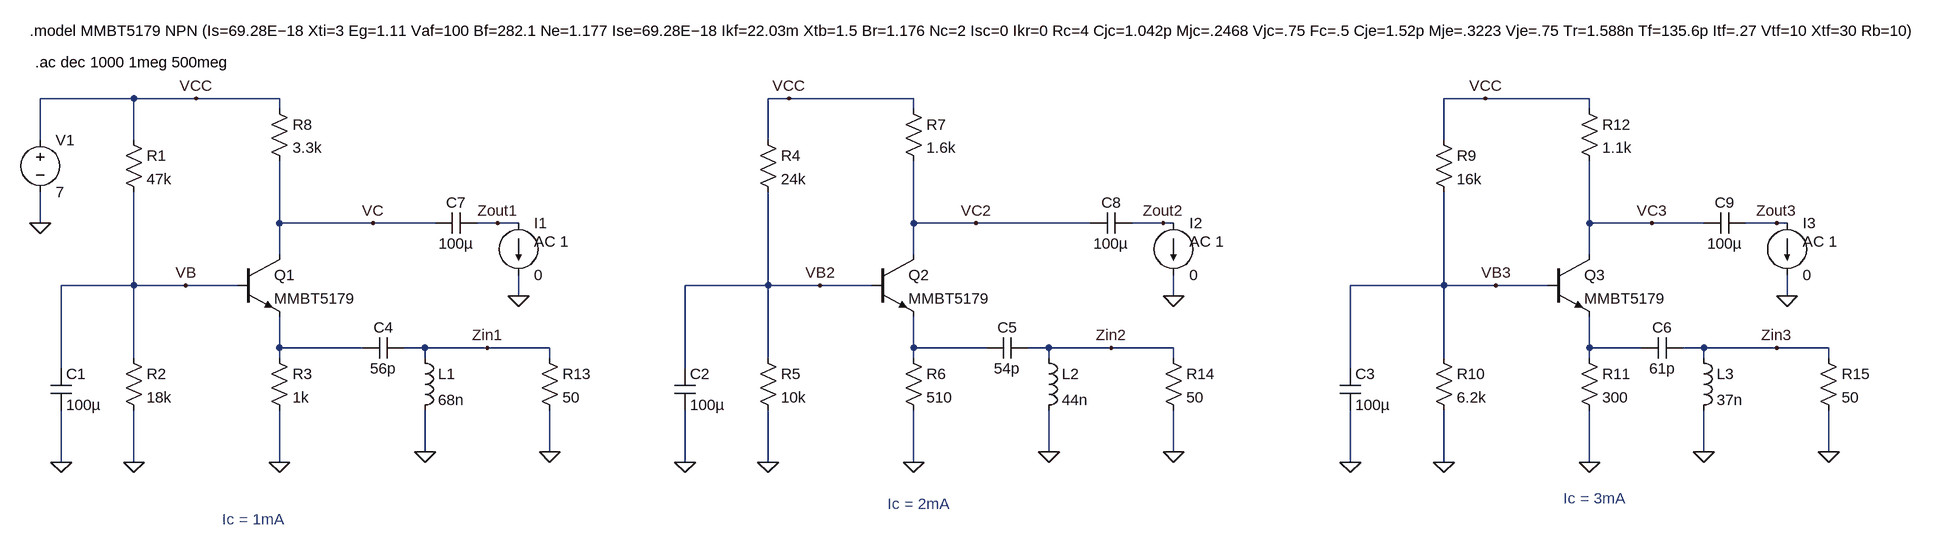
[diagram p0: schematic 5_Output_Impedance.asc]
5_Output_Impedance.asc, the LTspice schematic file:
Version 4
SHEET 1 1332 680
WIRE -2304 -1792 -2448 -1792
WIRE -2208 -1792 -2304 -1792
WIRE -2080 -1792 -2208 -1792
WIRE -1296 -1792 -1328 -1792
WIRE -1104 -1792 -1296 -1792
WIRE -224 -1792 -288 -1792
WIRE -64 -1792 -224 -1792
WIRE -2080 -1776 -2080 -1792
WIRE -1104 -1776 -1104 -1792
WIRE -64 -1776 -64 -1792
WIRE -2448 -1728 -2448 -1792
WIRE -2304 -1728 -2304 -1792
WIRE -1328 -1728 -1328 -1792
WIRE -288 -1728 -288 -1792
WIRE -2448 -1600 -2448 -1648
WIRE -2080 -1600 -2080 -1696
WIRE -1936 -1600 -2080 -1600
WIRE -1840 -1600 -1936 -1600
WIRE -1744 -1600 -1776 -1600
WIRE -1712 -1600 -1744 -1600
WIRE -1104 -1600 -1104 -1696
WIRE -1008 -1600 -1104 -1600
WIRE -832 -1600 -1008 -1600
WIRE -720 -1600 -768 -1600
WIRE -704 -1600 -720 -1600
WIRE -64 -1600 -64 -1696
WIRE 32 -1600 -64 -1600
WIRE 112 -1600 32 -1600
WIRE 224 -1600 176 -1600
WIRE 240 -1600 224 -1600
WIRE -2080 -1552 -2080 -1600
WIRE -1104 -1552 -1104 -1600
WIRE -64 -1552 -64 -1600
WIRE -2304 -1504 -2304 -1648
WIRE -2304 -1504 -2416 -1504
WIRE -2224 -1504 -2304 -1504
WIRE -2144 -1504 -2224 -1504
WIRE -1328 -1504 -1328 -1648
WIRE -1328 -1504 -1456 -1504
WIRE -1248 -1504 -1328 -1504
WIRE -1168 -1504 -1248 -1504
WIRE -288 -1504 -288 -1648
WIRE -288 -1504 -432 -1504
WIRE -208 -1504 -288 -1504
WIRE -128 -1504 -208 -1504
WIRE -1712 -1488 -1712 -1520
WIRE -704 -1488 -704 -1520
WIRE 240 -1488 240 -1520
WIRE -2080 -1408 -2080 -1456
WIRE -1952 -1408 -2080 -1408
WIRE -1856 -1408 -1888 -1408
WIRE -1760 -1408 -1856 -1408
WIRE -1664 -1408 -1760 -1408
WIRE -1104 -1408 -1104 -1456
WIRE -992 -1408 -1104 -1408
WIRE -896 -1408 -928 -1408
WIRE -800 -1408 -896 -1408
WIRE -704 -1408 -800 -1408
WIRE -64 -1408 -64 -1456
WIRE 16 -1408 -64 -1408
WIRE 112 -1408 80 -1408
WIRE 224 -1408 112 -1408
WIRE 304 -1408 224 -1408
WIRE -2304 -1392 -2304 -1504
WIRE -2080 -1392 -2080 -1408
WIRE -1856 -1392 -1856 -1408
WIRE -1664 -1392 -1664 -1408
WIRE -1328 -1392 -1328 -1504
WIRE -1104 -1392 -1104 -1408
WIRE -896 -1392 -896 -1408
WIRE -704 -1392 -704 -1408
WIRE -288 -1392 -288 -1504
WIRE -64 -1392 -64 -1408
WIRE 112 -1392 112 -1408
WIRE 304 -1392 304 -1408
WIRE -2416 -1376 -2416 -1504
WIRE -1456 -1376 -1456 -1504
WIRE -432 -1376 -432 -1504
WIRE -1856 -1248 -1856 -1312
WIRE -1664 -1248 -1664 -1312
WIRE -896 -1248 -896 -1312
WIRE -704 -1248 -704 -1312
WIRE 112 -1248 112 -1312
WIRE 304 -1248 304 -1312
WIRE -2416 -1232 -2416 -1312
WIRE -2304 -1232 -2304 -1312
WIRE -2080 -1232 -2080 -1312
WIRE -1456 -1232 -1456 -1312
WIRE -1328 -1232 -1328 -1312
WIRE -1104 -1232 -1104 -1312
WIRE -432 -1232 -432 -1312
WIRE -288 -1232 -288 -1312
WIRE -64 -1232 -64 -1312
FLAG -2448 -1600 0
FLAG -2304 -1232 0
FLAG -2080 -1232 0
FLAG -2224 -1504 VB
FLAG -1936 -1600 VC
FLAG -2208 -1792 VCC
FLAG -2416 -1232 0
FLAG -1328 -1232 0
FLAG -1104 -1232 0
FLAG -1248 -1504 VB2
FLAG -1008 -1600 VC2
FLAG -1296 -1792 VCC
FLAG -1456 -1232 0
FLAG -288 -1232 0
FLAG -64 -1232 0
FLAG -208 -1504 VB3
FLAG 32 -1600 VC3
FLAG -432 -1232 0
FLAG -224 -1792 VCC
FLAG -1664 -1248 0
FLAG -1856 -1248 0
FLAG -704 -1248 0
FLAG -896 -1248 0
FLAG 304 -1248 0
FLAG 112 -1248 0
FLAG -1760 -1408 Zin1
FLAG -800 -1408 Zin2
FLAG 224 -1408 Zin3
FLAG -1712 -1488 0
FLAG -704 -1488 0
FLAG 240 -1488 0
FLAG -1744 -1600 Zout1
FLAG -720 -1600 Zout2
FLAG 224 -1600 Zout3
SYMBOL res -2320 -1744 R0
SYMATTR InstName R1
SYMATTR Value 47k
SYMBOL res -2320 -1408 R0
SYMATTR InstName R2
SYMATTR Value 18k
SYMBOL res -2096 -1408 R0
SYMATTR InstName R3
SYMATTR Value 1k
SYMBOL voltage -2448 -1744 R0
WINDOW 123 0 0 Left 0
WINDOW 39 0 0 Left 0
SYMATTR InstName V1
SYMATTR Value 7
SYMBOL npn -2144 -1552 R0
SYMATTR InstName Q1
SYMATTR Value MMBT5179
SYMBOL cap -2432 -1376 R0
SYMATTR InstName C1
SYMATTR Value 100µ
SYMBOL res -1344 -1744 R0
SYMATTR InstName R4
SYMATTR Value 24k
SYMBOL res -1344 -1408 R0
SYMATTR InstName R5
SYMATTR Value 10k
SYMBOL res -1120 -1408 R0
SYMATTR InstName R6
SYMATTR Value 510
SYMBOL npn -1168 -1552 R0
SYMATTR InstName Q2
SYMATTR Value MMBT5179
SYMBOL cap -1472 -1376 R0
SYMATTR InstName C2
SYMATTR Value 100µ
SYMBOL res -1120 -1792 R0
SYMATTR InstName R7
SYMATTR Value 1.6k
SYMBOL res -2096 -1792 R0
SYMATTR InstName R8
SYMATTR Value 3.3k
SYMBOL res -304 -1744 R0
SYMATTR InstName R9
SYMATTR Value 16k
SYMBOL res -304 -1408 R0
SYMATTR InstName R10
SYMATTR Value 6.2k
SYMBOL res -80 -1408 R0
SYMATTR InstName R11
SYMATTR Value 300
SYMBOL npn -128 -1552 R0
SYMATTR InstName Q3
SYMATTR Value MMBT5179
SYMBOL cap -448 -1376 R0
SYMATTR InstName C3
SYMATTR Value 100µ
SYMBOL res -80 -1792 R0
SYMATTR InstName R12
SYMATTR Value 1.1k
SYMBOL cap -1888 -1424 R90
WINDOW 0 0 32 VBottom 2
WINDOW 3 32 32 VTop 2
SYMATTR InstName C4
SYMATTR Value 56p
SYMBOL ind -1872 -1408 R0
SYMATTR InstName L1
SYMATTR Value 68n
SYMBOL cap -928 -1424 R90
WINDOW 0 0 32 VBottom 2
WINDOW 3 32 32 VTop 2
SYMATTR InstName C5
SYMATTR Value 54p
SYMBOL ind -912 -1408 R0
SYMATTR InstName L2
SYMATTR Value 44n
SYMBOL cap 80 -1424 R90
WINDOW 0 0 32 VBottom 2
WINDOW 3 32 32 VTop 2
SYMATTR InstName C6
SYMATTR Value 61p
SYMBOL ind 96 -1408 R0
SYMATTR InstName L3
SYMATTR Value 37n
SYMBOL res -1680 -1408 R0
SYMATTR InstName R13
SYMATTR Value 50
SYMBOL res -720 -1408 R0
SYMATTR InstName R14
SYMATTR Value 50
SYMBOL res 288 -1408 R0
SYMATTR InstName R15
SYMATTR Value 50
SYMBOL current -1712 -1600 R0
WINDOW 123 24 28 Left 2
WINDOW 39 0 0 Left 0
SYMATTR InstName I1
SYMATTR Value 0
SYMATTR Value2 AC 1
SYMBOL cap -1776 -1616 R90
WINDOW 0 0 32 VBottom 2
WINDOW 3 32 32 VTop 2
SYMATTR InstName C7
SYMATTR Value 100µ
SYMBOL current -704 -1600 R0
WINDOW 123 24 28 Left 2
WINDOW 39 0 0 Left 0
SYMATTR InstName I2
SYMATTR Value 0
SYMATTR Value2 AC 1
SYMBOL cap -768 -1616 R90
WINDOW 0 0 32 VBottom 2
WINDOW 3 32 32 VTop 2
SYMATTR InstName C8
SYMATTR Value 100µ
SYMBOL current 240 -1600 R0
WINDOW 123 24 28 Left 2
WINDOW 39 0 0 Left 0
SYMATTR InstName I3
SYMATTR Value 0
SYMATTR Value2 AC 1
SYMBOL cap 176 -1616 R90
WINDOW 0 0 32 VBottom 2
WINDOW 3 32 32 VTop 2
SYMATTR InstName C9
SYMATTR Value 100µ
TEXT -2464 -1896 Left 2 !.model MMBT5179 NPN (Is=69.28E−18 Xti=3 Eg=1.11 Vaf=100 Bf=282.1 Ne=1.177 Ise=69.28E−18 Ikf=22.03m Xtb=1.5 Br=1.176 Nc=2 Isc=0 Ikr=0 Rc=4 Cjc=1.042p Mjc=.2468 Vjc=.75 Fc=.5 Cje=1.52p Mje=.3223 Vje=.75 Tr=1.588n Tf=135.6p Itf=.27 Vtf=10 Xtf=30 Rb=10)
TEXT -2456 -1848 Left 2 !.ac dec 1000 1meg 500meg
TEXT -2168 -1144 Left 2 ;Ic = 1mA
TEXT -1144 -1168 Left 2 ;Ic = 2mA
TEXT -104 -1176 Left 2 ;Ic = 3mA

The netlist it stands for:
* 5_Output_Impedance.asc
R1 VCC VB 47k
R2 VB 0 18k
R3 N001 0 1k
V1 VCC 0 7
Q1 VC VB N001 0 MMBT5179
C1 VB 0 100µ
R4 VCC VB2 24k
R5 VB2 0 10k
R6 N002 0 510
Q2 VC2 VB2 N002 0 MMBT5179
C2 VB2 0 100µ
R7 VCC VC2 1.6k
R8 VCC VC 3.3k
R9 VCC VB3 16k
R10 VB3 0 6.2k
R11 N003 0 300
Q3 VC3 VB3 N003 0 MMBT5179
C3 VB3 0 100µ
R12 VCC VC3 1.1k
C4 Zin1 N001 56p
L1 Zin1 0 68n
C5 Zin2 N002 54p
L2 Zin2 0 44n
C6 Zin3 N003 61p
L3 Zin3 0 37n
R13 Zin1 0 50
R14 Zin2 0 50
R15 Zin3 0 50
I1 Zout1 0 0 AC 1
C7 Zout1 VC 100µ
I2 Zout2 0 0 AC 1
C8 Zout2 VC2 100µ
I3 Zout3 0 0 AC 1
C9 Zout3 VC3 100µ
.model NPN NPN
.model PNP PNP
.lib standard.bjt
.model MMBT5179 NPN (Is=69.28E−18 Xti=3 Eg=1.11 Vaf=100 Bf=282.1 Ne=1.177 Ise=69.28E−18 Ikf=22.03m Xtb=1.5 Br=1.176 Nc=2 Isc=0 Ikr=0 Rc=4 Cjc=1.042p Mjc=.2468 Vjc=.75 Fc=.5 Cje=1.52p Mje=.3223 Vje=.75 Tr=1.588n Tf=135.6p Itf=.27 Vtf=10 Xtf=30 Rb=10)
.ac dec 1000 1meg 500meg
* Ic = 1mA
* Ic = 2mA
* Ic = 3mA
.backanno
.end